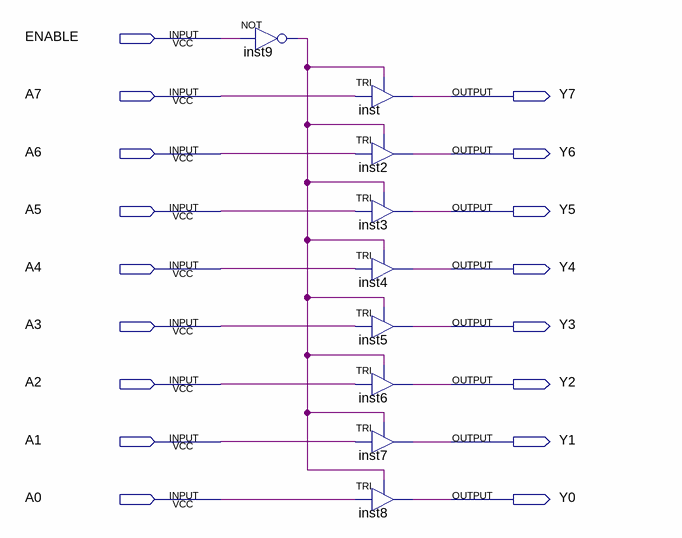
[diagram p0: schematic sheet]
// Quartus schematic Entrada_Tri_Saida.bdf as structural Verilog: 9 symbols, 17 pins
module Entrada_Tri_Saida (
  input  ENABLE,
  input  A7,
  input  A6,
  input  A5,
  input  A4,
  input  A3,
  input  A2,
  input  A1,
  input  A0,
  output Y7,
  output Y6,
  output Y5,
  output Y4,
  output Y3,
  output Y2,
  output Y1,
  output Y0
);

  wire inst9_out;

  not inst9 (inst9_out, ENABLE);
  TRI inst (.IN(A7), .OE(inst9_out), .OUT(Y7));
  TRI inst2 (.IN(A6), .OE(inst9_out), .OUT(Y6));
  TRI inst3 (.IN(A5), .OE(inst9_out), .OUT(Y5));
  TRI inst4 (.IN(A4), .OE(inst9_out), .OUT(Y4));
  TRI inst5 (.IN(A3), .OE(inst9_out), .OUT(Y3));
  TRI inst6 (.IN(A2), .OE(inst9_out), .OUT(Y2));
  TRI inst7 (.IN(A1), .OE(inst9_out), .OUT(Y1));
  TRI inst8 (.IN(A0), .OE(inst9_out), .OUT(Y0));
endmodule
